# Altium schematic sheet 2_MCU.SchDoc
size A3; DocumentNumber: 3; SheetNumber: 3; SheetTotal: 6; PageSetup: Record=PageOptions|CenterHorizontal=True|CenterVertical=True|PrintScale=1.01|XCorrection=1.00|YCorrection=1.00|PrintKind=0|BorderSize=5000000|LeftOffset=0|BottomOffset=0|Orientation=2|PaperLength=1000|PaperWidth=1000|Scale=100|PaperSource=7|PrintQuality=-4|MediaType=1|DitherType=10|PaperKind=A3|PrintScaleMode=1
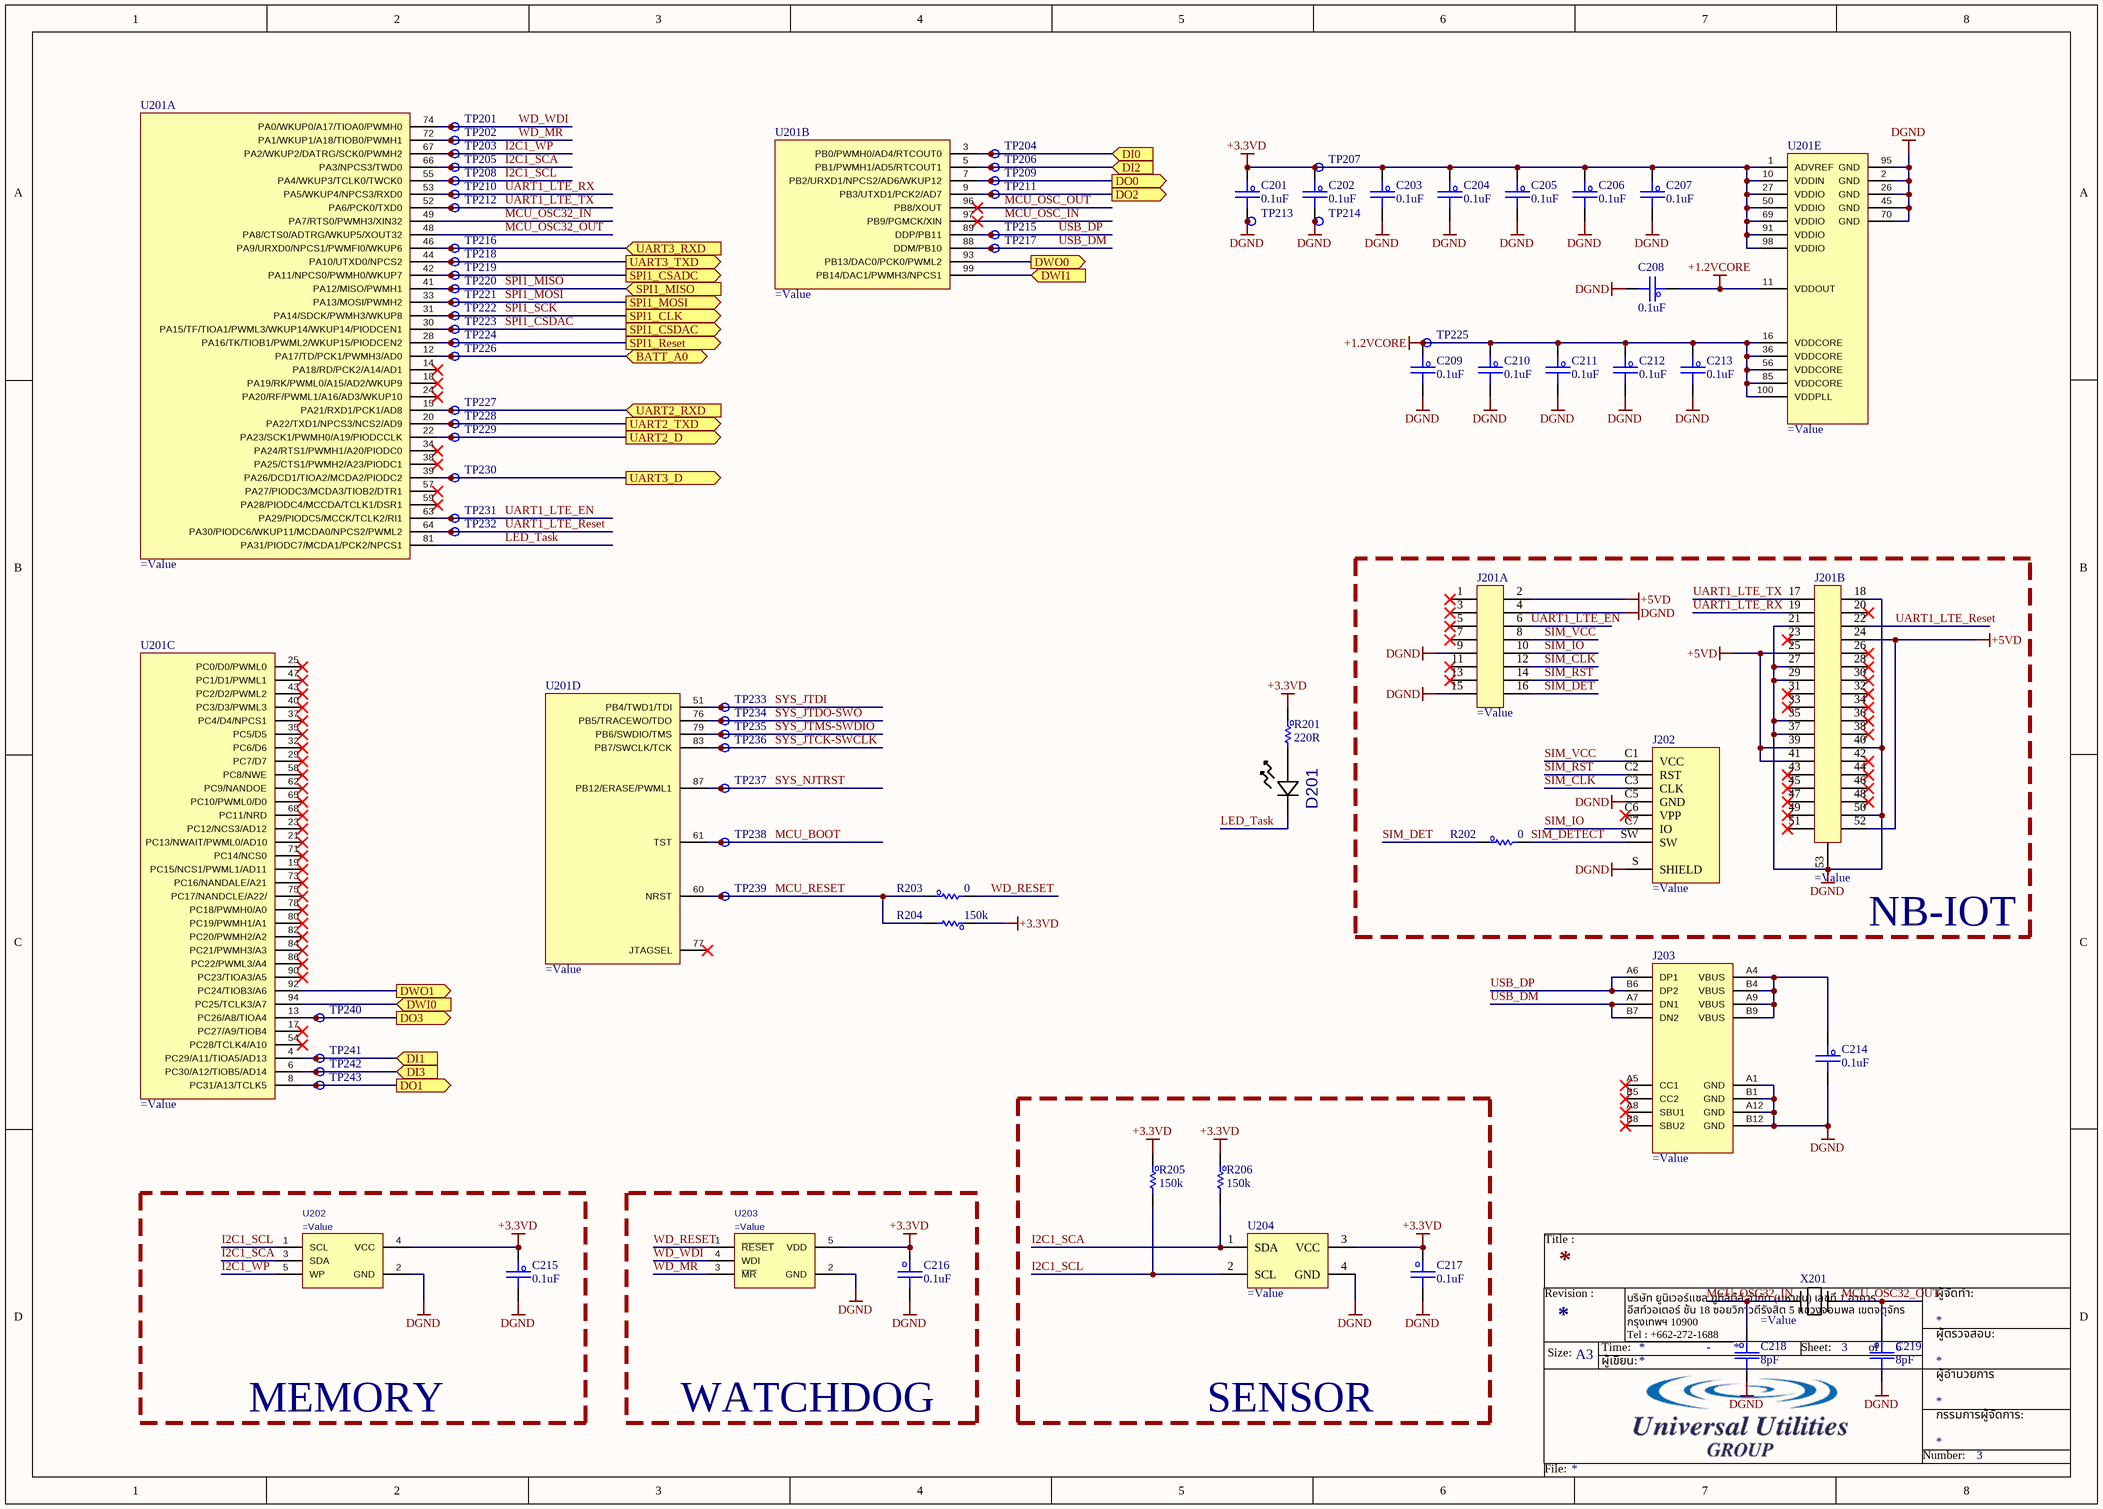
[diagram p0: 2_MCU.SchDoc]

## Parts
C201  0.1uF  [C_0603]
C202  0.1uF  [C_0603]
C203  0.1uF  [C_0603]
C204  0.1uF  [C_0603]
C205  0.1uF  [C_0603]
C206  0.1uF  [C_0603]
C207  0.1uF  [C_0603]
C208  0.1uF  [C_0603]
C209  0.1uF  [C_0603]
C210  0.1uF  [C_0603]
C211  0.1uF  [C_0603]
C212  0.1uF  [C_0603]
C213  0.1uF  [C_0603]
C214  0.1uF  [C_0603]
C215  0.1uF  [C_0603]
C216  0.1uF  [C_0603]
C217  0.1uF  [C_0603]
C218  8pF  [C_0603]  (no BOM)
C219  8pF  [C_0603]  (no BOM)
D201  (no value)  [LED_0VS75000_WRE]
J201  (no value)  [TE_2041119-1]  (parts A,B of 2)
J202  (no value)  [SIM8060-6-1-14-00-A_REVA]
J203  (no value)  [2137160001_MOL_2137160001(Primary)]
R201  220R  [R_0603]
R202  0  [R_0603]
R203  0  [R_0603]
R204  150k  [R_0603]
R205  150k  [R_0603]
R206  150k  [R_0603]
TP201  (no value)  [TP_Testpoint]  (no BOM)
TP202  (no value)  [TP_Testpoint]  (no BOM)
TP203  (no value)  [TP_Testpoint]  (no BOM)
TP204  (no value)  [TP_Testpoint]  (no BOM)
TP205  (no value)  [TP_Testpoint]  (no BOM)
TP206  (no value)  [TP_Testpoint]  (no BOM)
TP207  (no value)  [TP_Testpoint]  (no BOM)
TP208  (no value)  [TP_Testpoint]  (no BOM)
TP209  (no value)  [TP_Testpoint]  (no BOM)
TP210  (no value)  [TP_Testpoint]  (no BOM)
TP211  (no value)  [TP_Testpoint]  (no BOM)
TP212  (no value)  [TP_Testpoint]  (no BOM)
TP213  (no value)  [TP_Testpoint]  (no BOM)
TP214  (no value)  [TP_Testpoint]  (no BOM)
TP215  (no value)  [TP_Testpoint]  (no BOM)
TP216  (no value)  [TP_Testpoint]  (no BOM)
TP217  (no value)  [TP_Testpoint]  (no BOM)
TP218  (no value)  [TP_Testpoint]  (no BOM)
TP219  (no value)  [TP_Testpoint]  (no BOM)
TP220  (no value)  [TP_Testpoint]  (no BOM)
TP221  (no value)  [TP_Testpoint]  (no BOM)
TP222  (no value)  [TP_Testpoint]  (no BOM)
TP223  (no value)  [TP_Testpoint]  (no BOM)
TP224  (no value)  [TP_Testpoint]  (no BOM)
TP225  (no value)  [TP_Testpoint]  (no BOM)
TP226  (no value)  [TP_Testpoint]  (no BOM)
TP227  (no value)  [TP_Testpoint]  (no BOM)
TP228  (no value)  [TP_Testpoint]  (no BOM)
TP229  (no value)  [TP_Testpoint]  (no BOM)
TP230  (no value)  [TP_Testpoint]  (no BOM)
TP231  (no value)  [TP_Testpoint]  (no BOM)
TP232  (no value)  [TP_Testpoint]  (no BOM)
TP233  (no value)  [TP_Testpoint]  (no BOM)
TP234  (no value)  [TP_Testpoint]  (no BOM)
TP235  (no value)  [TP_Testpoint]  (no BOM)
TP236  (no value)  [TP_Testpoint]  (no BOM)
TP237  (no value)  [TP_Testpoint]  (no BOM)
TP238  (no value)  [TP_Testpoint]  (no BOM)
TP239  (no value)  [TP_Testpoint]  (no BOM)
TP240  (no value)  [TP_Testpoint]  (no BOM)
TP241  (no value)  [TP_Testpoint]  (no BOM)
TP242  (no value)  [TP_Testpoint]  (no BOM)
TP243  (no value)  [TP_Testpoint]  (no BOM)
U201  (no value)  [TQFP100_14X14M00]  (parts A,B,C,D,E of 5)
U202  (no value)  [SOT65P210X110-5N]
U203  (no value)  [DBV5]
U204  (no value)  [XDCR_SHT40-AD1B-R2]
X201  (no value)  [XTAL_CM315D_CF00]  (no BOM)

## Blocks framed on the sheet
NB-IOT: J201 J202 R202
SENSOR: C217 R205 R206 U204
MEMORY: C215 U202
WATCHDOG: C216 U203

## Ports
BATT_A0 (bidir), DI0 (in), DI1 (in), DI2 (in), DI3 (in), DO0 (out), DO1 (out), DO2 (out), DO3 (out), DWI0 (in), DWI1 (in), DWO0 (out), DWO1 (out), SPI1_CLK (out), SPI1_CSADC (out), SPI1_CSDAC (out), SPI1_MISO (in), SPI1_MOSI (out), SPI1_Reset (out), UART2_D (out), UART2_RXD (in), UART2_TXD (out), UART3_D (out), UART3_RXD (in), UART3_TXD (out)

## Nets
+1.2VCORE: C208.1 C209.1 C210.1 C211.1 C212.1 C213.1 TP225.1 U201.11(VDDOUT) U201.16(VDDCORE) U201.36(VDDCORE) U201.56(VDDCORE) U201.85(VDDCORE) U201.100(VDDPLL)
+3.3VD: C201.1 C202.1 C203.1 C204.1 C205.1 C206.1 C207.1 C215.1 C216.1 C217.1 R201.1 R204.1 R205.1 R206.1 TP207.1 U201.1(ADVREF) U201.10(VDDIN) U201.27(VDDIO) U201.50(VDDIO) U201.69(VDDIO) U201.91(VDDIO) U201.98(VDDIO) U202.4(VCC) U203.5(VDD) U204.3(VCC)
+5VD: J201.2 J201.24 J201.25 J201.39 J201.41 J201.52
DGND: C201.2 C202.2 C203.2 C204.2 C205.2 C206.2 C207.2 C208.2 C209.2 C210.2 C211.2 C212.2 C213.2 C214.2 C215.2 C216.2 C217.2 C218.2 C219.2 J201.4 J201.9 J201.15 J201.18 J201.21 J201.27 J201.29 J201.35 J201.37 J201.40 J201.50 J201.53 J202.C5(GND) J202.S(SHIELD) J203.A1(GND) J203.A12(GND) J203.B1(GND) J203.B12(GND) TP213.1 TP214.1 U201.2(GND) U201.26(GND) U201.45(GND) U201.70(GND) U201.95(GND) U202.2(GND) U203.2(GND) U204.4(GND)
BATT_A0: TP226.1 U201.12(PA17/TD/PCK1/PWMH3/AD0) ; port BATT_A0
DI0: TP204.1 U201.3(PB0/PWMH0/AD4/RTCOUT0) ; port DI0
DI1: TP241.1 U201.4(PC29/A11/TIOA5/AD13) ; port DI1
DI2: TP206.1 U201.5(PB1/PWMH1/AD5/RTCOUT1) ; port DI2
DI3: TP242.1 U201.6(PC30/A12/TIOB5/AD14) ; port DI3
DO0: TP209.1 U201.7(PB2/URXD1/NPCS2/AD6/WKUP12) ; port DO0
DO1: TP243.1 U201.8(PC31/A13/TCLK5) ; port DO1
DO2: TP211.1 U201.9(PB3/UTXD1/PCK2/AD7) ; port DO2
DO3: TP240.1 U201.13(PC26/A8/TIOA4) ; port DO3
DWI0: U201.94(PC25/TCLK3/A7) ; port DWI0
DWI1: U201.99(PB14/DAC1/PWMH3/NPCS1) ; port DWI1
DWO0: U201.93(PB13/DAC0/PCK0/PWML2) ; port DWO0
DWO1: U201.92(PC24/TIOB3/A6) ; port DWO1
I2C1_SCA: R206.2 TP205.1 U201.66(PA3/NPCS3/TWD0) U202.3(SDA) U204.1(SDA)
I2C1_SCL: R205.2 TP208.1 U201.55(PA4/WKUP3/TCLK0/TWCK0) U202.1(SCL) U204.2(SCL)
I2C1_WP: TP203.1 U201.67(PA2/WKUP2/DATRG/SCK0/PWMH2) U202.5(WP)
LED_Task: D201.1 U201.81(PA31/PIODC7/MCDA1/PCK2/NPCS1)
MCU_BOOT: TP238.1 U201.61(TST)
MCU_OSC32_IN: C218.1 U201.49(PA7/RTS0/PWMH3/XIN32) X201.1
MCU_OSC32_OUT: C219.1 U201.48(PA8/CTS0/ADTRG/WKUP5/XOUT32) X201.2
MCU_OSC_IN: U201.97(PB9/PGMCK/XIN)
MCU_OSC_OUT: U201.96(PB8/XOUT)
MCU_RESET: R203.1 R204.2 TP239.1 U201.60(NRST)
SIM_CLK: J201.12 J202.C3(CLK)
SIM_DET: J201.16 R202.1
SIM_DETECT: J202.SW R202.2
SIM_IO: J201.10 J202.C7(IO)
SIM_RST: J201.14 J202.C2(RST)
SIM_VCC: J201.8 J202.C1(VCC)
SPI1_CSADC: TP219.1 U201.42(PA11/NPCS0/PWMH0/WKUP7) ; port SPI1_CSADC
SPI1_CSDAC: TP223.1 U201.30(PA15/TF/TIOA1/PWML3/WKUP14/WKUP14/PIODCEN1) ; port SPI1_CSDAC
SPI1_MISO: TP220.1 U201.41(PA12/MISO/PWMH1) ; port SPI1_MISO
SPI1_MOSI: TP221.1 U201.33(PA13/MOSI/PWMH2) ; port SPI1_MOSI
SPI1_Reset: TP224.1 U201.28(PA16/TK/TIOB1/PWML2/WKUP15/PIODCEN2) ; port SPI1_Reset
SPI1_SCK: TP222.1 U201.31(PA14/SDCK/PWMH3/WKUP8) ; port SPI1_CLK
SYS_JTCK-SWCLK: TP236.1 U201.83(PB7/SWCLK/TCK)
SYS_JTDI: TP233.1 U201.51(PB4/TWD1/TDI)
SYS_JTDO-SWO: TP234.1 U201.76(PB5/TRACEWO/TDO)
SYS_JTMS-SWDIO: TP235.1 U201.79(PB6/SWDIO/TMS)
SYS_NJTRST: TP237.1 U201.87(PB12/ERASE/PWML1)
UART1_LTE_EN: J201.6 TP231.1 U201.63(PA29/PIODC5/MCCK/TCLK2/RI1)
UART1_LTE_Reset: J201.22 TP232.1 U201.64(PA30/PIODC6/WKUP11/MCDA0/NPCS2/PWML2)
UART1_LTE_RX: J201.19 TP210.1 U201.53(PA5/WKUP4/NPCS3/RXD0)
UART1_LTE_TX: J201.17 TP212.1 U201.52(PA6/PCK0/TXD0)
UART2_D: TP229.1 U201.22(PA23/SCK1/PWMH0/A19/PIODCCLK) ; port UART2_D
UART2_RXD: TP227.1 U201.15(PA21/RXD1/PCK1/AD8) ; port UART2_RXD
UART2_TXD: TP228.1 U201.20(PA22/TXD1/NPCS3/NCS2/AD9) ; port UART2_TXD
UART3_D: TP230.1 U201.39(PA26/DCD1/TIOA2/MCDA2/PIODC2) ; port UART3_D
UART3_RXD: TP216.1 U201.46(PA9/URXD0/NPCS1/PWMFI0/WKUP6) ; port UART3_RXD
UART3_TXD: TP218.1 U201.44(PA10/UTXD0/NPCS2) ; port UART3_TXD
USB_DM: J203.A7(DN1) J203.B7(DN2) TP217.1 U201.88(DDM/PB10)
USB_DP: J203.A6(DP1) J203.B6(DP2) TP215.1 U201.89(DDP/PB11)
WD_MR: TP202.1 U201.72(PA1/WKUP1/A18/TIOB0/PWMH1) U203.3(~{MR})
WD_RESET: R203.2 U203.1(~{RESET})
WD_WDI: TP201.1 U201.74(PA0/WKUP0/A17/TIOA0/PWMH0) U203.4(WDI)
NetC214_1: C214.1 J203.A4(VBUS) J203.A9(VBUS) J203.B4(VBUS) J203.B9(VBUS)
NetD201_2: D201.2 R201.2

Not connected (* = marked no-connect by the designer): J201 1* 3* 5* 7* 11* 13* 20* 23* 26* 28* 30* 31* 32* 33* 34* 36* 38* 42* 43* 44* 45* 46* 47* 48* 49* 51*; J202 C6(VPP)*; J203 A5(CC1)* A8(SBU1)* B5(CC2)* B8(SBU2)*; U201 14(PA18/RD/PCK2/A14/AD1)* 17(PC27/A9/TIOB4)* 18(PA19/RK/PWML0/A15/AD2/WKUP9)* 19(PC15/NCS1/PWML1/AD11)* 21(PC13/NWAIT/PWML0/AD10)* 23(PC12/NCS3/AD12)* 24(PA20/RF/PWML1/A16/AD3/WKUP10)* 25(PC0/D0/PWML0)* 29(PC7/D7)* 32(PC6/D6)* 34(PA24/RTS1/PWMH1/A20/PIODC0)* 35(PC5/D5)* 37(PC4/D4/NPCS1)* 38(PA25/CTS1/PWMH2/A23/PIODC1)* 40(PC3/D3/PWML3)* 43(PC2/D2/PWML2)* 47(PC1/D1/PWML1)* 54(PC28/TCLK4/A10)* 57(PA27/PIODC3/MCDA3/TIOB2/DTR1)* 58(PC8/NWE)* 59(PA28/PIODC4/MCCDA/TCLK1/DSR1)* 62(PC9/NANDOE)* 65(PC10/PWML0/D0)* 68(PC11/NRD)* 71(PC14/NCS0)* 73(PC16/NANDALE/A21)* 75(PC17/NANDCLE/A22/)* 77(JTAGSEL)* 78(PC18/PWMH0/A0)* 80(PC19/PWMH1/A1)* 82(PC20/PWMH2/A2)* 84(PC21/PWMH3/A3)* 86(PC22/PWML3/A4)* 90(PC23/TIOA3/A5)*

## Notes on the sheet
- Title :
- Revision :
- ผู้จัดทำ:
- Size:
- A3
- Time:
- ผู้เขียน:
- บริษัท ยูนิเวอร์แซล ยูทีลิตี้ส์ จำกัด (มหาชน) เลขที่ 1 อาคาร อีสท์วอเตอร์ ชั้น 18 ซอยวิภาวดีรังสิต 5 แขวงจอมพล เขตจตุจักร กรุงเทพฯ 10900
  Tel : +662-272-1688
  Fax :+662-2721690-1
- -
- Sheet:
- of
- ผู้อำนวยการ
- ผู้ตรวจสอบ:
- Number:
- กรรมการผู้จัดการ:
- File:

## Library data of the parts
C201-C217 = C_Capacitor: CAP CER 0.1UF 50V X7R 0603; Manufacturer: KEMET; PartNumber: C0603C104K5RACTU; PackageReference: 0603; PartID: 399-5089-1-ND; Value2: 50V; Value: 0.1uF; Value3: *
C218 C219 = C_Capacitor: Capacitor; Manufacturer: KEMET; PartNumber: CBR06C809B5GAC; Value2: 6.3V; PackageReference: 0603; PartID: 399-CBR06C809B5GACCT-ND; Value: 8pF; Value3: *
D201 = D_LED_150060BS75000: LED BLUE CLEAR 0603 SMD; Manufacturer: Wurth Electronics; Value: 150060VS75000; PackageReference: 0603; PartID: 732-4980-1-ND; PartNumber: 150060VS75000
J201 = CON_PCI-E-52P: CONN PCI EXP MINI FEMALE 52POS; PartNumber: 2041119-1; Manufacturer: TE Connectivity AMP Connectors; Value: 2041119-1; PartID: A108265CT-ND; PackageReference: *; Value2: *; Value3: *
J202 = CON_SIM_Nano_Top: CONN SIM NANO HINGED 6P W/SWITCH; PartNumber: SIM8060-6-1-14-00-A; Manufacturer: GCT; Value: SIM8060-6-1-14-00-A; PartID: 640-SIM8060611400A; PackageReference: *; Value2: *; Value3: *
J203 = CON_USBC: CONN RCPT USB2.0 TYPE C 24POS RA; PartNumber: 2137160001; Manufacturer: Molex; Value: 2137160001; PartID: 900-2137160001CT-ND; PackageReference: *; Value2: *; Value3: *
R201 = R_Resister: RES SMD 220 OHM 1% 1/10W 0603; Manufacturer: Vishay Dale; PartNumber: CRCW0603220RFKEAC; Value2: 0.1W; Value: 220R; PackageReference: 0603; PartID: 541-4047-1-ND; Value3: *
R202 R203 = R_Resister: RES SMD 0 OHM JUMP 1/10W 0603; Manufacturer: Vishay Dale; PartNumber: CRCW06030000Z0EBC; Value2: 0.1W; Value: 0; PackageReference: 0603; PartID: 541-4013-1-ND; Value3: *
R204-R206 = R_Resister: RES SMD 150K OHM 1% 1/10W 0603; Manufacturer: Vishay Dale; PartNumber: CRCW0603150KFKEAC; Value2: 0.1W; Value: 150k; PackageReference: 0603; PartID: 541-4034-1-ND; Value3: *
TP201-TP243 = TP_TestPoint: TestPoint; Manufacturer: *; PackageReference: *; PartID: *; PartNumber: *; Value2: *; Value3: *
U201 = IC_MCU_ATSAM4SA16CA: IC MCU 32BIT 1MB FLASH 100LQFP; Manufacturer: Microchip Technology; PartNumber: ATSAM4SA16CA-AUR; Value: ATSAM4SA16CA-AUR; PackageReference: 100-LQFP; PartID: ATSAM4SA16CA-AURCT-ND
U202 = IC_MEM_24AA02HT: IC EEPROM 2KBIT I2C SC70-5; Manufacturer: Microchip Technology; Value: 24AA02HT-I/LT; PackageReference: SC-70-5; PartID: 24AA02HT-I/LTCT-ND; PartNumber: 24AA02HT-I/LT
U203 = IC_WDT_TPS3828-33DBVTG4: Processor Supervisory Circuits; Manufacturer: Texas Instruments; Value: TPS3828-33DBVTG4; PackageReference: SOT-23; PartID: 296-52797-1-ND; PartNumber: TPS3828-33DBVTG4
U204 = IC_SEN_SHT40-AD1B-R3: SENSOR HUMIDITY 100 RH SMD; Manufacturer: Sensirion AG; PartNumber: SHT40-AD1B-R3; PartID: 1649-SHT40-AD1B-R3CT-ND; PackageReference: QFN-4; Value: SHT40-AD1B-R3; Value2: *; Value3: *
X201 = X_32_768MHz: CRYSTAL 32.7680KHZ 7PF SMD; PartNumber: CM315D32768DZYT; Manufacturer: Citizen Finedevice Co Ltd; Value: CM315D32768DZYT; PartID: 300-8815-1-ND; PackageReference: *; Value2: *; Value3: *